# Altium schematic sheet Sheet1.SchDoc
size A3
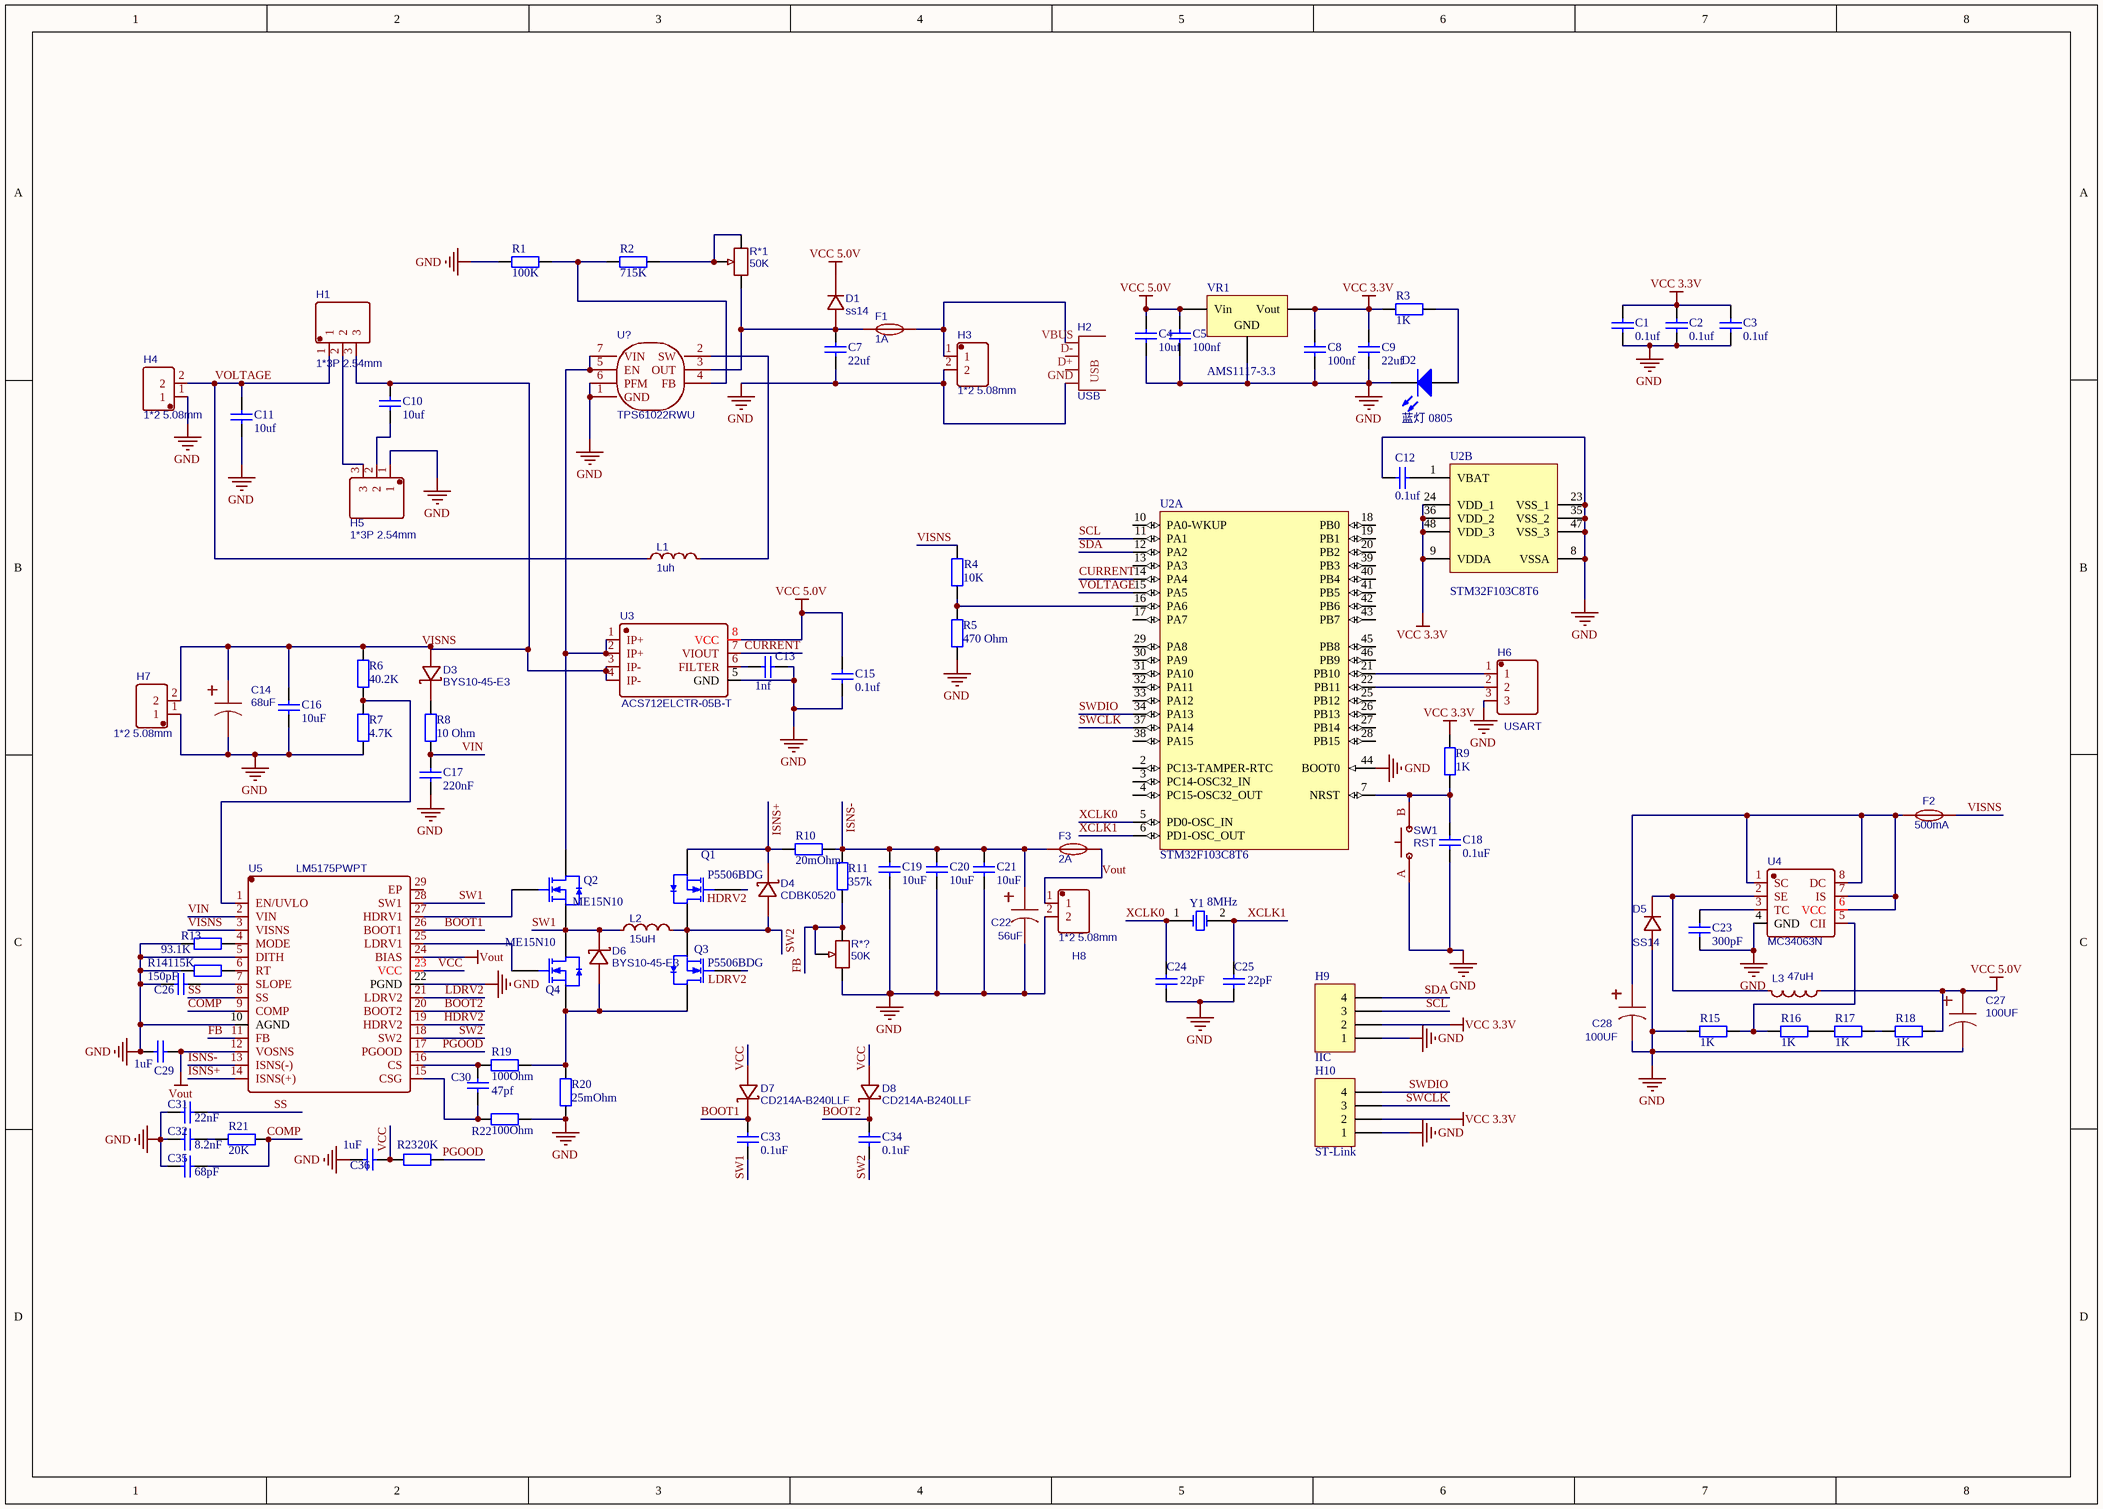
[diagram p0: Sheet1.SchDoc]

## Parts
C1  0.1uf  [0805_C]
C2  0.1uf  [0805_C]
C3  0.1uf  [0805_C]
C4  10uf  [0805_C]
C5  100nf  [0805_C]
C7  22uf  [0805_C]
C8  100nf  [0805_C]
C9  22uf  [0805_C]
C10  10uf  [0805_C]
C11  10uf  [0805_C]
C12  0.1uf  [0805_C]
C13  1nf  [0805_C]
C14  68uF  [CAP-SMD_BD12.5-L13.0-W13.0-FD]
C15  0.1uf  [0805_C]
C16  10uF  [0805_C]
C17  220nF  [0805_C]
C18  0.1uF  [0805_C]
C19  10uF  [0805_C]
C20  10uF  [0805_C]
C21  10uF  [0805_C]
C22  56uF  [CAP-SMD_BD6.3-L6.6-W6.6-RD]
C23  300pF  [0805_C]
C24  22pF  [0805_C]
C25  22pF  [0805_C]
C26  150pF  [0805_C]
C27  100UF  [CAP-TH_BD10.0-P5.00-D1.0-FD]
C28  100UF  [CAP-TH_BD10.0-P5.00-D1.0-FD]
C29  1uF  [0805_C]
C30  47pf  [0805_C]
C31  22nF  [0805_C]
C32  8.2nF  [0805_C]
C33  0.1uF  [0805_C]
C34  0.1uF  [0805_C]
C35  68pF  [0805_C]
C36  1uF  [0805_C]
D1  ss14  [SMA]
D2  蓝灯 0805  [0805_LED_S1]
D3  BYS10-45-E3  [SMA_L4.4-W2.8-LS5.4-RD]
D4  CDBK0520  [SOD-123F]
D5  SS14  [SMA]
D6  BYS10-45-E3  [SMA_L4.4-W2.8-LS5.4-RD]
D7  CD214A-B240LLF  [DO-214AC_L4.3-W2.7-LS5.3-FD]
D8  CD214A-B240LLF  [SMA_L4.4-W2.8-LS5.4-RD]
F1  1A  [F1210]
F2  500mA  [F1210]
F3  2A  [F1210]
H1  1*3P 2.54mm  [HDR-TH_3P-P2.54-V]
H2  USB  [USB-A-S]
H3  1*2 5.08mm  [CONN-TH_2P-P5.08_31320102]
H4  1*2 5.08mm  [CONN-TH_2P-P5.08_31320102]
H5  1*3P 2.54mm  [HDR-TH_3P-P2.54-V]
H6  USART  [HDR-TH_3P-P2.54-V]
H7  1*2 5.08mm  [CONN-TH_2P-P5.08_31320102]
H8  1*2 5.08mm  [CONN-TH_2P-P5.08_31320102]
H9  IIC  [HDR1X4]
H10  ST-Link  [HDR1X4]
L1  1uh  [IND-SMD_L12.5-W12.5_SWRH1207B]
L2  15uH  [IND-SMD_L12.5-W12.5_SWRH1207B]
L3  47uH  [IND-SMD_L12.5-W12.5_SWRH1207B]
Q1  P5506BDG  [TO-252-2]
Q2  ME15N10  [TO-252-2]
Q3  P5506BDG  [TO-252-2]
Q4  ME15N10  [TO-252-2]
R1  100K  [0805_R]
R2  715K  [0603_R]
R3  1K  [0805_R]
R4  10K  [0805_R]
R5  470 Ohm  [0805_R]
R6  40.2K  [0603_R]
R7  4.7K  [0805_R]
R8  10 Ohm  [0805_R]
R9  1K  [0805_R]
R10  20mOhm  [0805_R]
R11  357k  [1206]
R13  93.1K  [0603_R]
R14  115K  [0805_R]
R15  1K  [0805_R]
R16  1K  [0805_R]
R17  1K  [0805_R]
R18  1K  [0805_R]
R19  100Ohm  [0805_R]
R20  25mOhm  [1206]
R21  20K  [0603_R]
R22  100Ohm  [0805_R]
R23  20K  [0603_R]
R*1  50K  [RES-ADJ-TH_3P-L9.5-W4.9-P2.50-L_3296W]
R*?  50K  [RES-ADJ-TH_3P-L9.5-W4.9-P2.50-L_3296W]
SW1  RST  [SW-SMD_L3.5-W6.0-P8.00]
U2  STM32F103C8T6  [LQFP-48_L7.0-W7.0-P0.50-LS9.0-BL]  (parts A,B of 2)
U3  ACS712ELCTR-05B-T  [SOIC-8_L5.0-W4.0-P1.27-LS6.0-BL]
U4  MC34063N  [DIP-8_L9.8-W6.6-P2.54-LS7.6-BL]
U5  LM5175PWPT  [HTSSOP-28_L9.8-W4.5-P0.65-LS6.6-BL-EP]
U?  TPS61022RWU  [VQFN7]
VR1  AMS1117-3.3  [SOT-223]
Y1  8MHz  [SMD-5032_2P]

## Nets
GND: C1.1 C2.1 C3.1 C4.1 C5.1 C7.1 C8.1 C9.1 C11.2 C12.1 C13.2 C14.2 C15.1 C16.1 C17.1 C18.1 C19.1 C20.1 C21.1 C22.2 C23.1 C24.1 C25.1 C26.1 C27.2 C28.2 C29.1 C31.2 C32.2 C35.2 C36.1 D2.K D5.1 H2.GND H3.2 H4.1 H5.1 H6.3 H7.1 H8.2 H9.1 H10.1 R1.1 R5.1 R7.1 R13.1 R14.1 R15.1 R20.1 R22.2 R*?.1 SW1.A U2.8(VSSA) U2.23(VSS_1) U2.35(VSS_2) U2.44(BOOT0) U2.47(VSS_3) U3.5(GND) U4.4(GND) U5.5(DITH) U5.10(AGND) U5.22(PGND) U?.1(GND) U?.6(PFM) VR1.1(GND)
VCC 3.3V: C1.2 C2.2 C3.2 C8.2 C9.2 H9.2 H10.2 R3.1 R9.2 U2.9(VDDA) U2.24(VDD_1) U2.36(VDD_2) U2.48(VDD_3) VR1.2(Vout)
VCC 5.0V: C4.2 C5.2 C15.2 C27.1 D1.2 L3.1 R18.2 U3.8(VCC) VR1.3(Vin)
Vout: C29.2 F3.1 H8.1 U5.12(VOSNS) U5.24(BIAS)
BOOT1: C33.2 D7.1(C) U5.26(BOOT1)
BOOT2: C34.2 D8.1(C) U5.20(BOOT2)
COMP: C35.1 R21.2 U5.9(COMP)
CURRENT: U2.14(PA4) U3.7(VIOUT)
FB: R11.1 R*?.2 R*?.3 U5.11(FB)
HDRV2: Q1.1(G) U5.19(HDRV2)
ISNS+: D4.1(C) Q1.2(S) R10.1 U5.14(ISNS(+))
ISNS-: C19.2 C20.2 C21.2 C22.1 F3.2 R10.2 R11.2 U5.13(ISNS(-))
LDRV2: Q3.1(G) U5.21(LDRV2)
PGOOD: R23.2 U5.17(PGOOD)
SCL: H9.3 U2.11(PA1)
SDA: H9.4 U2.12(PA2)
SS: C31.1 U5.8(SS)
SW1: C33.1 D6.1(C) L2.1 Q2.2(S) Q4.3(D) U5.28(SW1)
SW2: C34.1 D4.2(A) L2.2 Q1.3(D) Q3.2(S) U5.18(SW2)
SWCLK: H10.3 U2.37(PA14)
SWDIO: H10.4 U2.34(PA13)
VCC: C36.2 D7.2(A) D8.2(A) R23.1 U5.23(VCC)
VIN: C17.2 R8.1 U5.2(VIN)
VISNS: F2.2 R4.2 U5.3(VISNS)
VOLTAGE: C11.1 H1.1 H4.2 L1.1 U2.15(PA5)
XCLK0: C24.2 U2.5(PD0-OSC_IN) Y1.1(OSC1)
XCLK1: C25.2 U2.6(PD1-OSC_OUT) Y1.2(OSC2)
NetC7_2: C7.2 D1.1 F1.1 R*1.1 U?.3(OUT)
NetC10_1: C10.1 C14.1 C16.2 D3.2(A) H1.3 H7.2 R6.2 U3.3(IP-) U3.4(IP-)
NetC10_2: C10.2 H5.2
NetC12_2: C12.2 U2.1(VBAT)
NetC13_1: C13.1 U3.6(FILTER)
NetC18_2: C18.2 R9.1 SW1.B U2.7(NRST)
NetC23_2: C23.2 U4.3(TC)
NetC26_2: C26.2 U5.7(SLOPE)
NetC28_1: C28.1 F2.1 U4.1(SC) U4.6(VCC) U4.7(IS) U4.8(DC)
NetC30_1: C30.1 R22.1 U5.15(CSG)
NetC30_2: C30.2 R19.1 U5.16(CS)
NetC32_1: C32.1 R21.1
NetD2_A: D2.A R3.2
NetD3_1: D3.1(C) R8.2
NetD5_2: D5.2 L3.2 U4.2(SE)
NetD6_2: D6.2(A) Q3.3(D) Q4.2(S) R19.2 R20.2
NetF1_2: F1.2 H2.VBUS H3.1
NetH1_2: H1.2 H5.3
NetH6_1: H6.1 U2.21(PB10)
NetH6_2: H6.2 U2.22(PB11)
NetL1_2: L1.2 U?.2(SW)
NetQ2_1: Q2.1(G) U5.27(HDRV1)
NetQ2_3: Q2.3(D) U3.1(IP+) U3.2(IP+) U?.5(EN) U?.7(VIN)
NetQ4_1: Q4.1(G) U5.25(LDRV1)
NetR1_2: R1.2 R2.1 U?.4(FB)
NetR2_2: R2.2 R*1.2 R*1.3
NetR4_1: R4.1 R5.2 U2.16(PA6)
NetR6_1: R6.1 R7.2 U5.1(EN/UVLO)
NetR13_2: R13.2 U5.4(MODE)
NetR14_2: R14.2 U5.6(RT)
NetR15_2: R15.2 R16.1 U4.5(CII)
NetR16_2: R16.2 R17.1
NetR17_2: R17.2 R18.1

Not connected (* = marked no-connect by the designer): H2 D+ D-; U2 2(PC13-TAMPER-RTC) 3(PC14-OSC32_IN) 4(PC15-OSC32_OUT) 10(PA0-WKUP) 13(PA3) 17(PA7) 18(PB0) 19(PB1) 20(PB2) 25(PB12) 26(PB13) 27(PB14) 28(PB15) 29(PA8) 30(PA9) 31(PA10) 32(PA11) 33(PA12) 38(PA15) 39(PB3) 40(PB4) 41(PB5) 42(PB6) 43(PB7) 45(PB8) 46(PB9); U5 29(EP)

## Notes on the sheet
- Labels drawn without touching a wire or pin: VISNS

## Library data of the parts
C1-C3 C7 C10-C12 C16 C17 C19-C21 C26 C29-C36 = C_非极性电容: 贴片电容; ComponentLink1Description: 供应商链接; ComponentLink1URL: http://www.szlcsc.com/product/details_8509.html; Package: 0805; Supplier: LC; SuppliersPartNumber: C8031
C4 C9 = 1206 470pF (471) 10% 50V: 贴片电容; ComponentLink1Description: 供应商链接; ComponentLink1URL: http://www.szlcsc.com/product/details_2220.html; Package: 1206; Supplier: LC; SuppliersPartNumber: C1868
C5 C8 = 0805 2.7pF (2R7) 0.25pF 50V: 贴片电容; ComponentLink1Description: 供应商链接; ComponentLink1URL: http://www.szlcsc.com/product/details_2155.html; Package: 0805; Supplier: LC; SuppliersPartNumber: C1803
C13 C15 C23 = C_贴片: 贴片电容; ComponentLink1Description: 供应商链接; ComponentLink1URL: http://www.szlcsc.com/product/details_8509.html; Package: 0805; Supplier: LC; SuppliersPartNumber: C8031
C14 C22 = C_极性电容: BOM_Manufacturer: Lelon; BOM_Manufacturer Part: VE-331M1E0810-TRO; nameAlias: Capacitance; Contributor: LCSC; BOM_Supplier: LCSC; BOM_Supplier Part: C249523; spicePre: C; spiceSymbolName: VE-331M1E0810-TRO
C18 = 0805 27pF (270) 5% 50V: 贴片电容; ComponentLink1Description: 供应商链接; ComponentLink1URL: http://www.szlcsc.com/product/details_8509.html; Package: 0805; Supplier: LC; SuppliersPartNumber: C8031
C24 C25 = 0805 22pF (220) 5% 50V: 贴片电容; ComponentLink1Description: 供应商链接; ComponentLink1URL: http://www.szlcsc.com/product/details_2156.html; Package: 0805; Supplier: LC; SuppliersPartNumber: C1804
C27 C28 = C_SDM贴片电解: BOM_Manufacturer: Lelon; BOM_Manufacturer Part: VE-331M1E0810-TRO; nameAlias: Capacitance; Contributor: LCSC; BOM_Supplier: LCSC; BOM_Supplier Part: C249523; spicePre: C; spiceSymbolName: VE-331M1E0810-TRO
D1 D5 = SS14: BOM_Manufacturer: 长电; Contributor: LZCG; BOM_pre: TXP.033; BOM_Supplier Part: undefined; BOM_Supplier: LCSC; spicePre: D; spiceSymbolName: SS14
D2 = 0805 蓝灯: 发光二极管; ComponentLink1Description: 供应商链接; ComponentLink1URL: http://www.szlcsc.com/product/details_2666.html; Package: 0805; Supplier: LC; SuppliersPartNumber: C2293
D3 D4 D6-D8 = 稳压二极管: BOM_Manufacturer: DIODES; BOM_Manufacturer Part: DFLZ10-7; Contributor: LCSC; BOM_Supplier Part: C151371; BOM_Supplier: LCSC; spicePre: D; spiceSymbolName: DFLZ10-7
F1-F3 = 1210保险丝: BOM_Manufacturer: Fuzetec Tech; BOM_Manufacturer Part: FSMD020-1210-R; Contributor: LCSC; BOM_Supplier: LCSC; BOM_Supplier Part: C224190; spicePre: F; spiceSymbolName: FSMD020-1210-R
H1 H5 H6 = 1*3 2.54mm: BOM_Manufacturer: Ckmtw; BOM_Manufacturer Part: 210S-1*3P L=11.6MMGold-plated black; Contributor: LCSC; BOM_Supplier: LCSC; BOM_Supplier Part: C124376; spicePre: H; spiceSymbolName: 210S-1*3P L=11.6MMGold-plated black
H2 = USB-A: Contributor: SparkFun; sourceId: HhbsKEWew; timeStamp: 1472634994; spicePre: J; spiceSymbolName: USB
H3 H4 H7 H8 = 1*2 5.08mm: BOM_Manufacturer: METZ CONNECT; BOM_Manufacturer Part: 31320102; Contributor: LCSC; BOM_Supplier: LCSC; BOM_Supplier Part: C123228; spicePre: C; spiceSymbolName: 31320102
H9 H10 = 1*4 2.54mm: LatestRevisionDate: 17-Jul-2002; LatestRevisionNote: Re-released for DXP Platform.; Publisher: Altium Limited
L1 L3 = L功率贴片电感7*7*4: BOM_Manufacturer: TDK; BOM_Manufacturer Part: SLF7045T-331MR25-PF; nameAlias: Inductance; BOM_Supplier: LCSC; BOM_Supplier Part: C136202; spicePre: L; spiceSymbolName: CDRH74R 7*7*4MM 贴片电感
L2 = L功率贴片电感: BOM_Manufacturer: TDK; BOM_Manufacturer Part: SLF7045T-331MR25-PF; nameAlias: Inductance; BOM_Supplier: LCSC; BOM_Supplier Part: C136202; spicePre: L; spiceSymbolName: CDRH74R 7*7*4MM 贴片电感
Q1-Q4 = AO3400A N道沟 X0YV1T SOT-23: MOS(场效应管); ComponentLink1Description: 供应商链接; ComponentLink1URL: http://www.szlcsc.com/product/details_21629.html; Package: SOT-23; Supplier: LC; SuppliersPartNumber: C20917
R1 R2 R4-R8 R10 R11 R13-R23 = R: 贴片电阻; ComponentLink1Description: 供应商链接; ComponentLink1URL: http://www.szlcsc.com/product/details_18202.html; Package: 0805; Supplier: LC; SuppliersPartNumber: C17514
R3 = 0805 R: 贴片电阻; ComponentLink1Description: 供应商链接; ComponentLink1URL: http://www.szlcsc.com/product/details_18202.html; Package: 0805; Supplier: LC; SuppliersPartNumber: C17514
R9 = 0805 1.2KΩ (1201) 1%: 贴片电阻; ComponentLink1Description: 供应商链接; ComponentLink1URL: http://www.szlcsc.com/product/details_18067.html; Package: 0805; Supplier: LC; SuppliersPartNumber: C17379
R*1 R*? = R_可调: BOM_Manufacturer: Chengdu Guosheng Tech; BOM_Manufacturer Part: 3296W-1-100; Resistance(Ohms): 10; nameAlias: Resistance (Ohms); Contributor: LCSC; BOM_Supplier: LCSC; BOM_Supplier Part: C118900; spicePre: R; spiceSymbolName: 3296W-1-100
SW1 = 贴片微动开关: BOM_Manufacturer: HYP; BOM_Manufacturer Part: 1TS002C-1800-4300; Contributor: LCSC; BOM_Supplier: LCSC; BOM_Supplier Part: C255795; spicePre: S; spiceSymbolName: 1TS002C-1800-4300
U2 = STM32F103C8T6: ARM Cortex-M3 32-bit MCU, 64 KB Flash, 20 KB Internal RAM, 37 I/Os, 48-pin LQFP, -40 to 85 degC, Tray; A/D Converter: 2x12-bit (10 Channel); FLASH Size (Prog) (kB): 64; I/Os (High Current): 37; Internal RAM Size (kB): 20; Operating Frequency(F) (Processor speed) (MHz): 72; Supply Voltage(Vcc) min (V): 2; DatasheetVersion: Rev. 16; PackageVersion: Rev. 6, 06/2013; PackageReference: LQFP48; PackageDescription: 48-Pin Low Profile Quad Flat Package, 7 x 7 mm Body, 0.5 mm Pitch; Supplier 1: Digi-Key; Supplier Part Number 1: 497-6063-ND; Supplier 2: Farnell; Supplier Part Number 2: 1447637; Supplier 3: Newark; Supplier Part Number 3: 59M2182; Supplier 4: Newark; Supplier Part Number 4: 57P1222; Supplier 5: Mouser; Supplier Part Number 5: 511-STM32F103C8T6; Core: ARM Cortex-M3; Packing: Tray; Mounting Technology: Surface Mount; PartNumber: STM32F103C8T6; ComponentLink1Description: Manufacturer URL; ComponentLink1URL: http://www.st.com/web/en/home.html; ComponentLink2Description: Datasheet; ComponentLink2URL: http://www.st.com/st-web-ui/static/active/en/resource/technical/document/datasheet/CD00161566.pdf; ComponentLink3Description: Package Specification; ComponentLink3URL: http://www.st.com/st-web-ui/static/active/en/resource/technical/document/datasheet/DM00058181.pdf
U3 = ACS712ELCTR-05B-T: BOM_Manufacturer: ALLEGRO; SMT Type: Extend; spicePre: X; BOM_Supplier: LCSC; BOM_Manufacturer Part: ACS712ELCTR-05B-T; image: //image.lceda.cn/szlcsc/C44471.jpg; BOM_Supplier Part: C44471; BOM_LCSC Assembly: Yes; spiceSymbolName: ACS712ELCTR-05B-T
U4 = MC34063N: BOM_Manufacturer: HGSEMI; Contributor: LCSC; BOM_Supplier: LCSC; BOM_Supplier Part: C444399; BOM_Manufacturer Part: MC34063N; spicePre: U; spiceSymbolName: MC34063N
U5 = LM5175PWPT: BOM_Manufacturer: Texas Instruments; Contributor: LCSC; SMT Type: Extend; BOM_Supplier: LCSC; BOM_Supplier Part: C181517; BOM_Manufacturer Part: LM5175PWPT; BOM_LCSC Assembly: Yes; spicePre: U; spiceSymbolName: LM5175PWPT
U? = TPS61022RWU: Contributor: luoyangcheng; spicePre: U; spiceSymbolName: TPS61022RWU
VR1 = SOT-223 AMS1117-3.3: 低压差线性稳压(LDO); ComponentLink1Description: 供应商链接; ComponentLink1URL: http://www.szlcsc.com/product/details_6652.html; Package: SOT-223; Supplier: LC; SuppliersPartNumber: C6186
Y1 = SMD-5032_2P 8MHz 20ppm 20pF: 贴片晶振; ComponentLink1Description: 供应商链接; ComponentLink1URL: http://www.szlcsc.com/product/details_117214.html; Package: SMD-5032_2P; Supplier: LC; SuppliersPartNumber: C115962